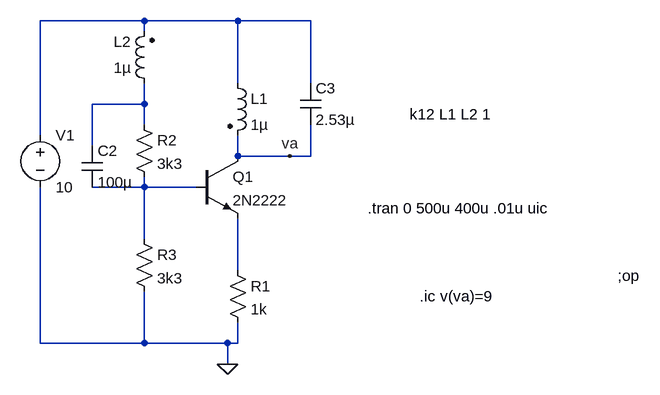
[diagram p0: schematic sintonizado.asc]
sintonizado.asc, the LTspice schematic file:
Version 4
SHEET 1 880 680
WIRE 48 -144 -112 -144
WIRE 192 -144 48 -144
WIRE 304 -144 192 -144
WIRE 48 -128 48 -144
WIRE 192 -48 192 -144
WIRE 304 -48 304 -144
WIRE 48 -16 48 -48
WIRE 48 -16 -32 -16
WIRE 48 16 48 -16
WIRE -112 32 -112 -144
WIRE -32 48 -32 -16
WIRE 192 64 192 32
WIRE 272 64 192 64
WIRE 304 64 304 16
WIRE 304 64 272 64
WIRE 48 112 48 96
WIRE 48 112 -32 112
WIRE 128 112 48 112
WIRE 48 192 48 112
WIRE 192 240 192 160
WIRE -112 352 -112 112
WIRE 48 352 48 272
WIRE 48 352 -112 352
WIRE 176 352 48 352
WIRE 192 352 192 320
WIRE 192 352 176 352
WIRE 176 384 176 352
FLAG 176 384 0
FLAG 272 64 va
SYMBOL npn 128 64 R0
SYMATTR InstName Q1
SYMATTR Value 2N2222
SYMBOL voltage -112 16 R0
WINDOW 123 0 0 Left 2
WINDOW 39 0 0 Left 2
SYMATTR InstName V1
SYMATTR Value 10
SYMBOL res 176 224 R0
SYMATTR InstName R1
SYMATTR Value 1k
SYMBOL res 32 0 R0
SYMATTR InstName R2
SYMATTR Value 3k3
SYMBOL res 32 176 R0
SYMATTR InstName R3
SYMATTR Value 3k3
SYMBOL cap -48 48 R0
SYMATTR InstName C2
SYMATTR Value 100µ
SYMBOL ind2 176 -64 R0
SYMATTR InstName L1
SYMATTR Value 1µ
SYMBOL cap 288 -48 R0
SYMATTR InstName C3
SYMATTR Value 2.53µ
SYMBOL ind2 64 -32 R180
WINDOW 0 36 80 Left 2
WINDOW 3 36 40 Left 2
SYMATTR InstName L2
SYMATTR Value 1µ
TEXT 456 0 Left 2 !k12 L1 L2 1
TEXT 472 280 Left 2 !.ic v(va)=9
TEXT 392 144 Left 2 !.tran 0 500u 400u .01u uic
TEXT 776 248 Left 2 !;op

The netlist it stands for:
* sintonizado.asc
Q1 va N003 N004 0 2N2222
V1 N001 0 10
R1 N004 0 1k
R2 N002 N003 3k3
R3 N003 0 3k3
C2 N002 N003 100µ
L1 N001 va 1µ
C3 N001 va 2.53µ
L2 N002 N001 1µ
.model NPN NPN
.model PNP PNP
.lib standard.bjt
k12 L1 L2 1
.ic v(va)=9
.tran 0 500u 400u .01u uic
;op
.backanno
.end